# Altium project RelayArray SMD.PrjPcb
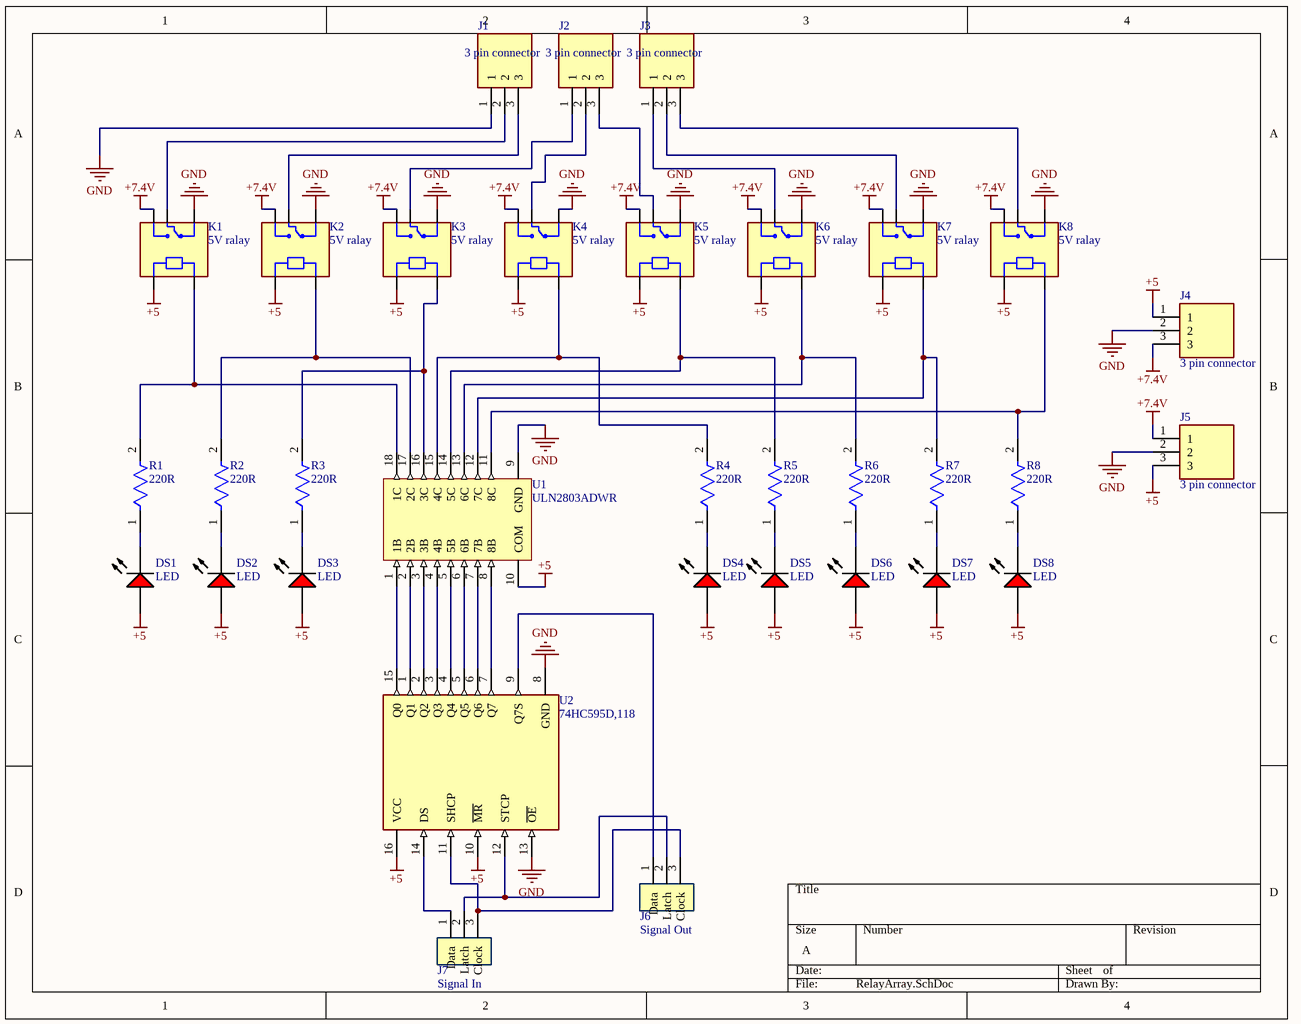
[diagram p0: RelayArray.SchDoc]
1 sheet, 33 parts. Net scope: global (net labels, ports and power ports of the same name join across sheets).
Board files: PCB3.PcbDoc, PCB2.PcbDoc, PCB1.PcbDoc

## Sheet RelayArray.SchDoc
size A; SheetNumber: 1; SheetTotal: 1

### Parts
DS1  LED  [big red led]
DS2  LED  [big red led]
DS3  LED  [big red led]
DS4  LED  [big red led]
DS5  LED  [big red led]
DS6  LED  [big red led]
DS7  LED  [big red led]
DS8  LED  [big red led]
J1  3 pin connector  [3 pin connector]
J2  3 pin connector  [3 pin connector]
J3  3 pin connector  [3 pin connector]
J4  3 pin connector  [3 pin connector]
J5  3 pin connector  [3 pin connector]
J6  Signal Out  [3 pin header]
J7  Signal In  [3 pin header]
K1  5V ralay  [RELAY_SRD-05VDC-SL-C]
K2  5V ralay  [RELAY_SRD-05VDC-SL-C]
K3  5V ralay  [RELAY_SRD-05VDC-SL-C]
K4  5V ralay  [RELAY_SRD-05VDC-SL-C]
K5  5V ralay  [RELAY_SRD-05VDC-SL-C]
K6  5V ralay  [RELAY_SRD-05VDC-SL-C]
K7  5V ralay  [RELAY_SRD-05VDC-SL-C]
K8  5V ralay  [RELAY_SRD-05VDC-SL-C]
R1  220R  [FP-CRCW0805-e3-IPC_A]
R2  220R  [FP-CRCW0805-e3-IPC_A]
R3  220R  [FP-CRCW0805-e3-IPC_A]
R4  220R  [FP-CRCW0805-e3-IPC_A]
R5  220R  [FP-CRCW0805-e3-IPC_A]
R6  220R  [FP-CRCW0805-e3-IPC_A]
R7  220R  [FP-CRCW0805-e3-IPC_A]
R8  220R  [FP-CRCW0805-e3-IPC_A]
U1  ULN2803ADWR  [DW0018A_L]
U2  74HC595D,118  [FP-SOT109-1-IPC_C]

### Nets
+5: DS1.1(A) DS2.1(A) DS3.1(A) DS4.1(A) DS5.1(A) DS6.1(A) DS7.1(A) DS8.1(A) J4.1 J5.3 K1.A1 K2.A1 K3.A1 K4.A1 K5.A1 K6.A1 K7.A1 K8.A1 U1.10(COM) U2.10(~{MR}) U2.16(VCC)
+7.4V: J4.3 J5.1 K1.NO K2.NO K3.NO K4.NO K5.NO K6.NO K7.NO K8.NO
GND: J1.1 J4.2 J5.2 K1.NC K2.NC K3.NC K4.NC K5.NC K6.NC K7.NC K8.NC U1.9(GND) U2.8(GND) U2.13(~{OE})
NetDS1_2: DS1.2(K) R1.1
NetDS2_2: DS2.2(K) R2.1
NetDS3_2: DS3.2(K) R3.1
NetDS4_2: DS4.2(K) R4.1
NetDS5_2: DS5.2(K) R5.1
NetDS6_2: DS6.2(K) R6.1
NetDS7_2: DS7.2(K) R7.1
NetDS8_2: DS8.2(K) R8.1
NetJ1_2: J1.2 K1.COM
NetJ1_3: J1.3 K2.COM
NetJ2_1: J2.1 K3.COM
NetJ2_2: J2.2 K4.COM
NetJ2_3: J2.3 K5.COM
NetJ3_1: J3.1 K6.COM
NetJ3_2: J3.2 K7.COM
NetJ3_3: J3.3 K8.COM
NetJ6_1: J6.1(Data) U2.9(Q7S)
NetJ6_2: J6.2(Latch) J7.2(Latch) U2.12(STCP)
NetJ6_3: J6.3(Clock) J7.3(Clock) U2.11(SHCP)
NetJ7_1: J7.1(Data) U2.14(DS)
NetK1_A2: K1.A2 R1.2 U1.18(1C)
NetK2_A2: K2.A2 R2.2 U1.17(2C)
NetK3_A2: K3.A2 R3.2 U1.16(3C)
NetK4_A2: K4.A2 R4.2 U1.15(4C)
NetK5_A2: K5.A2 R5.2 U1.14(5C)
NetK6_A2: K6.A2 R6.2 U1.13(6C)
NetK7_A2: K7.A2 R7.2 U1.12(7C)
NetK8_A2: K8.A2 R8.2 U1.11(8C)
NetU1_1: U1.1(1B) U2.15(Q0)
NetU1_2: U1.2(2B) U2.1(Q1)
NetU1_3: U1.3(3B) U2.2(Q2)
NetU1_4: U1.4(4B) U2.3(Q3)
NetU1_5: U1.5(5B) U2.4(Q4)
NetU1_6: U1.6(6B) U2.5(Q5)
NetU1_7: U1.7(7B) U2.6(Q6)
NetU1_8: U1.8(8B) U2.7(Q7)

### Library data of the parts
DS1-DS8 = big red led: T-1 3/4 (5 mm) Diffused LED Lamp, 1.9 V, -40 to 100 degC, 2-Pin THD, RoHS, Bulk; Manufacturer: Avago; Forward Current: 25mA; Forward Voltage: 2.4V; Peak Wavelength: 635nm; Shape Type: Circular; High Brightness: No; Main Category: StandardLED; Test Current (It): 10mA; Dominant Wave Length: 626nm; Number of  Elements: 1; Reverse Voltage: 5V; Chip Material: GaP; Product Height (mm): 9.19mm; Lens Type: ColoredDiffused; Viewing Angle: 60deg; Type: Uni-Color; Emitting Color: Red; Luminous Intensity: 5.4mcd; Power Dissipation: 85W; DELETED: Compliant; Product Depth (mm): 6.1mm; Package Description: 2-Pin Through Hole LED, Dia 5.85 mm; Mounting Technology: ThroughHole; Manufacturer URL: http://www.avagotech.com/; Package Type: T-13/4; Operating Temp Range: -40Cto100C; Datasheet URL: http://www.avagotech.com/docs/AV02-1558EN; Mounting: ThroughHole; Lens Dimensions: 5.08x5.08x8.3mm; Package Reference: HLMP-3301; Datasheet Version: 03/2015; Pin Count: 2; Packaging: TapeandReel; Operating Temperature Classification: Industrial; Lum Intensity: 5.4mcd; Rad Hardened: No; Product Length (mm): 6.1mm
J1-J5 = 3 pin connector: 3P,STRAIGHT,SIDE ENTRY,3.5MM; MF: TE Connectivity; MP: 1546551-3; Price: None; SnapEDA_Link: https://www.snapeda.com/parts/1546551-3/TE%20Connectivity%20AMP%20Connectors/view-part/2360652/?ref=snap; Availability: Unavailable; Value: *; Package: None
J6 J7 = 3 pin header: 3P,STRAIGHT,SIDE ENTRY,3.5MM; MF: TE Connectivity; MP: 1546551-3; Price: None; SnapEDA_Link: https://www.snapeda.com/parts/1546551-3/TE%20Connectivity%20AMP%20Connectors/view-part/2360652/?ref=snap; Availability: Unavailable; Value: *; Package: None
K1-K8 = 5V ralay: 5V Trigger Relay Module For Arduino And Raspberry Pi 5V Trigger Relay Module For Arduino And Raspberry Pi; MF: Songle Relay; MP: SRD-05VDC-SL-C; Check_prices: https://www.snapeda.com/parts/SRD-05VDC-SL-C/Songle+Relay/view-part/?ref=eda; Value: *; Availability: Not in stock; Price: None; Package: NON STANDARD-5 Songle Relay; SnapEDA_Link: https://www.snapeda.com/parts/SRD-05VDC-SL-C/Songle+Relay/view-part/?ref=snap
R1-R8 = CMP-2001-03682-2: RES Thick Film, 220Ω, 1%, 0.125W, 100ppm/°C, 0805; Max Power Dissipation: 125mW; Voltage Rating: 150V; Packaging: Tape and Reel; Termination: SMD/SMT; Height: 0.45mm; Package Quantity: 10; Width: 0.049inch; Min Operating Temperature: -55°C; Lead Free: Lead Free; Military Standard: Not; Mount: Surface Mount; Max Operating Temperature: 155°C; Voltage Rating (DC): 150V; Resistance: 220R; Composition: Thick Film; Case/Package: 0805; Length: 2mm; Weight: 0.000194oz; Case Code (Metric): 2012; Number of Terminations: 2; Case Code (Imperial): 0805; Radiation Hardening: No; Tolerance: 1%; Features: Automotive AEC-Q200; Power Rating: 125mW; Depth: 1.25mm; Contact Plating: Tin; Temperature Coefficient: 100ppm/°C; JLC: C17540
U1 = CMP-2000-07354-1: Darlington Transistor Array, -40 to 85 degC, 18-Pin SOIC (DW), Green (RoHS & no Sb/Br), Tape and Reel; Manufacturer: Texas Instruments; Package Version: 4040000-3/G, 01/2011; Other Names: 296-15777-6; Voltage - Supply: 5V; IR Max: 50uA; Number of Drivers/Receivers: 8/0; VF: 1.7V; Dynamic Catalog: DarlingtonArrays; Package Description: 18-Pin Plastic Small Outline, Body 11.55 x 7.5 mm, Pitch 1.27 mm; Mounting Technology: SurfaceMount; Packaging: Digi-Reel®; Protocol: -; Family: Interface-Drivers,Receivers,Transceivers; Package Reference: DW18; Mounting Type: SurfaceMount; Type: DarlingtonArray; Category: IntegratedCircuits(ICs); Series: -; PartNumber: ULN2803A; Manufacturer URL: http://www.ti.com/; Package / Case: 18-SOIC(0.295",7.50mmWidth); Standard Package: 1; Datasheet Version: Rev. G, 01/2015; Supplier Device Package: 18-SOIC; Package URL: http://www.ti.com/lit/ml/mpds172a/mpds172a.pdf; Datasheet URL: http://www.ti.com/lit/ds/symlink/uln2803a.pdf; JLC: C845537
U2 = CMP-14351-000006-1: IC SHIFT REGISTER 8BIT 16SOIC; RoHS Compliant: Yes; JLC: C5947